# Altium schematic sheet H3_Power.SchDoc
size A3
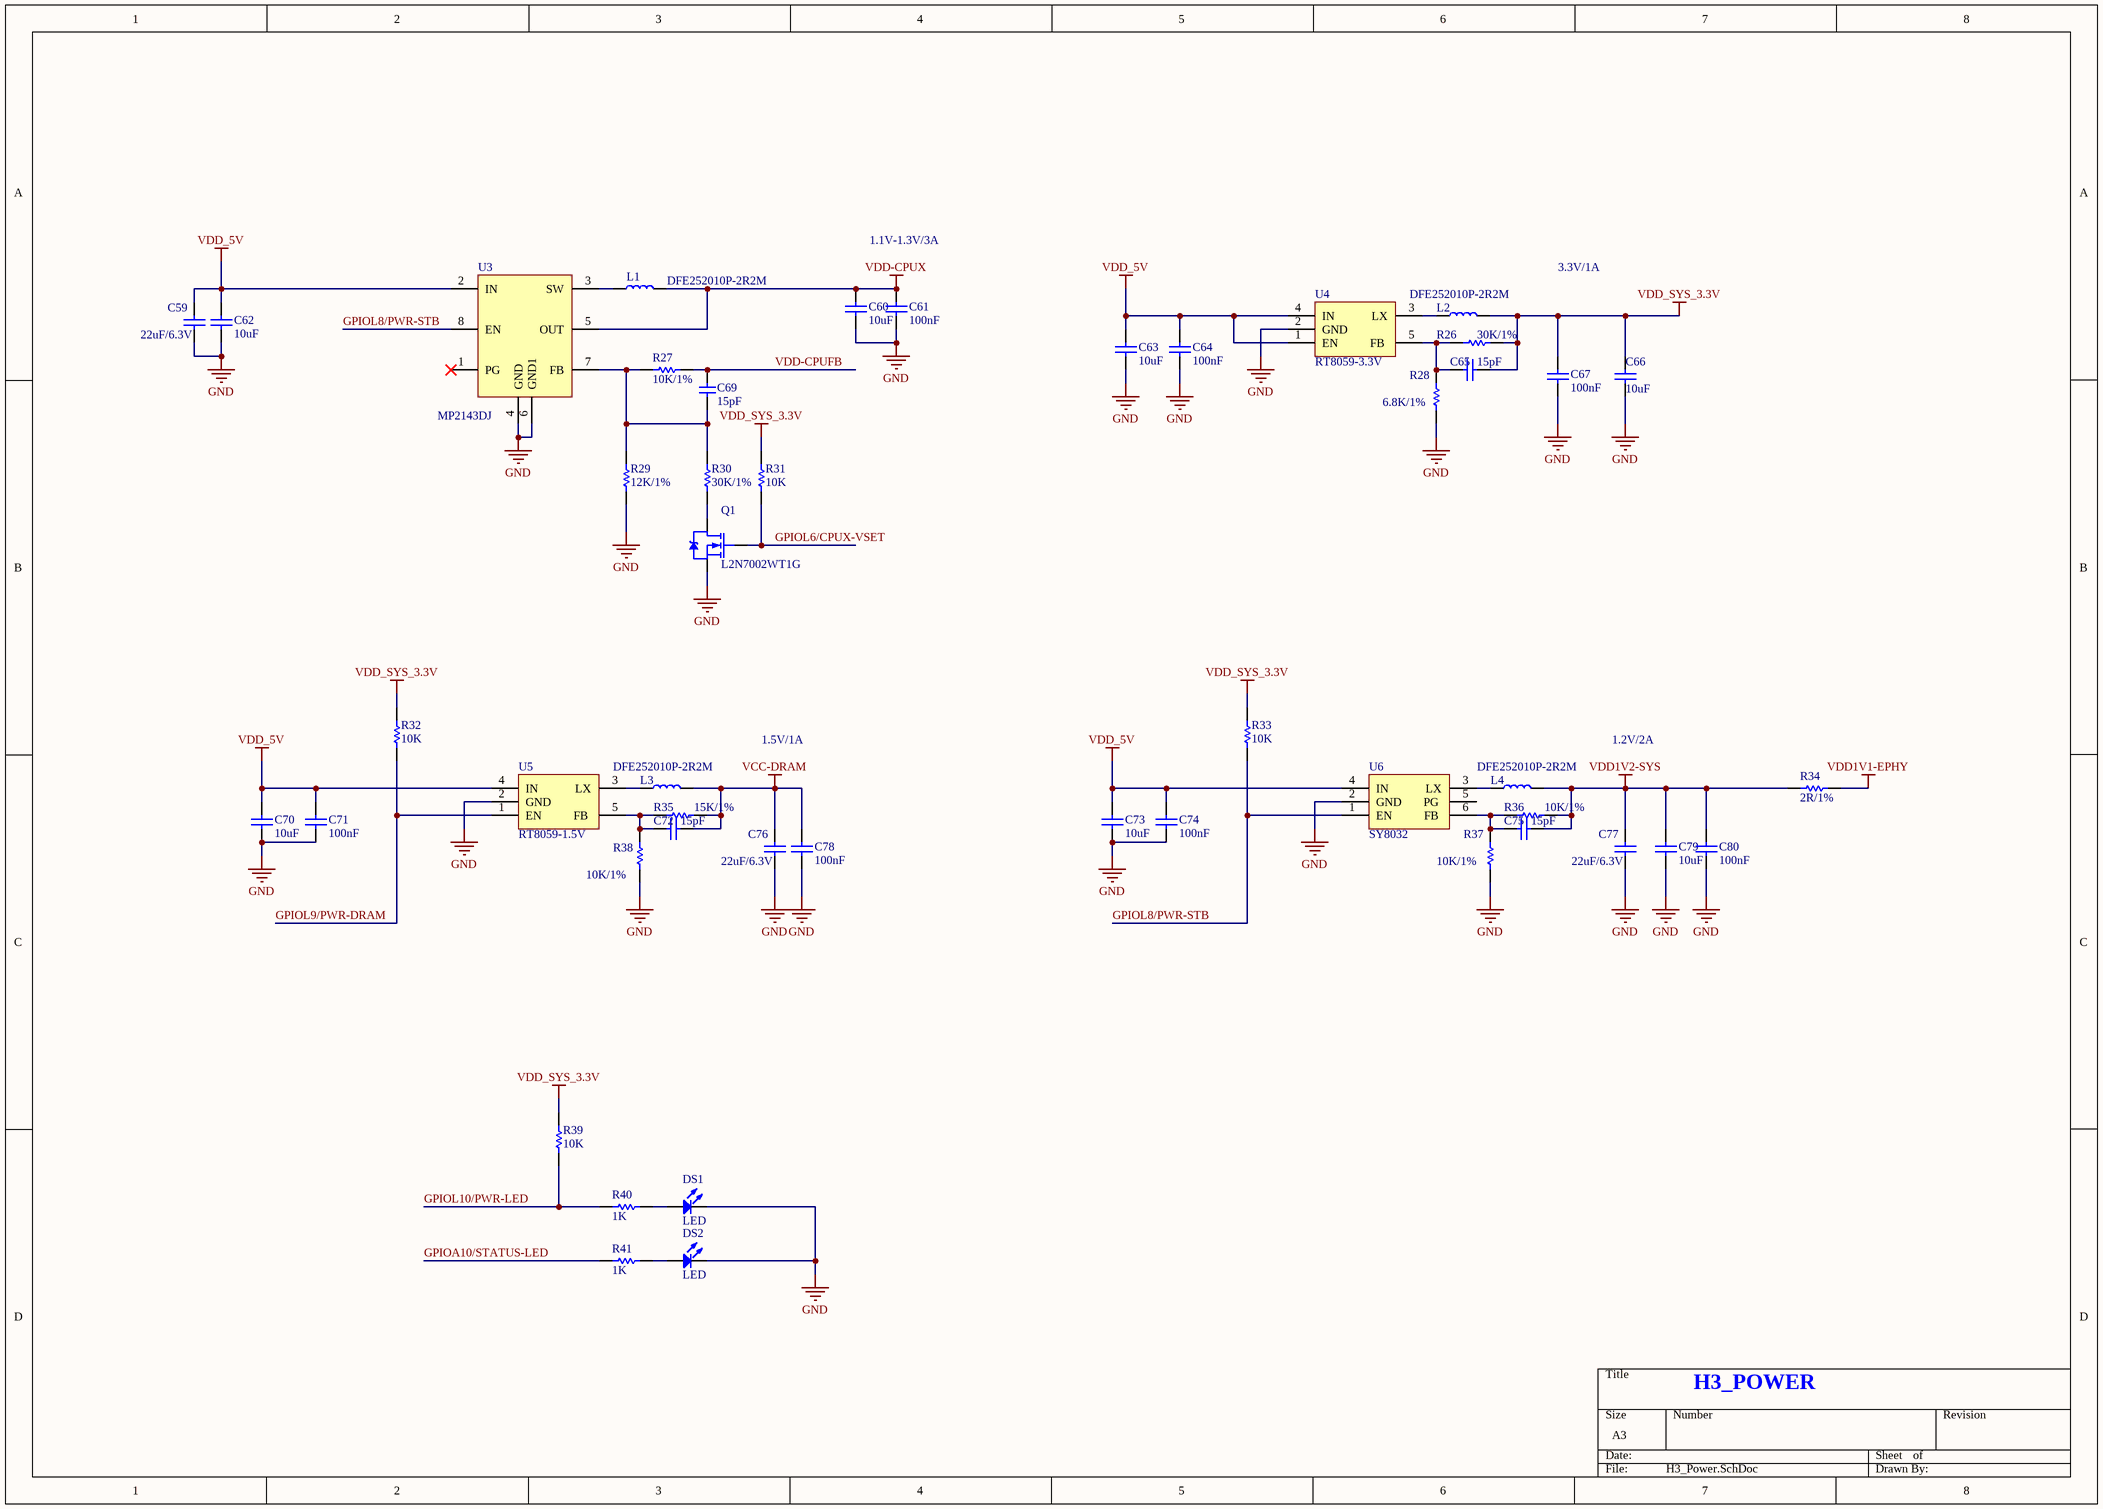
[diagram p0: H3_Power.SchDoc]

## Parts
C59  22uF/6.3V  [C0603]
C60  10uF  [C0603]
C61  100nF  [C0402]
C62  10uF  [C0603]
C63  10uF  [C0603]
C64  100nF  [C0402]
C65  15pF  [C0402]
C66  10uF  [C0603]
C67  100nF  [C0402]
C69  15pF  [C0402]
C70  10uF  [C0603]
C71  100nF  [C0402]
C72  15pF  [C0402]
C73  10uF  [C0603]
C74  100nF  [C0402]
C75  15pF  [C0402]
C76  22uF/6.3V  [C0603]
C77  22uF/6.3V  [C0603]
C78  100nF  [C0402]
C79  10uF  [C0603]
C80  100nF  [C0402]
DS1  LED  [LED0603]
DS2  LED  [LED0603]
L1  DFE252010P-2R2M  [L2520]
L2  DFE252010P-2R2M  [L2520]
L3  DFE252010P-2R2M  [L2520]
L4  DFE252010P-2R2M  [L2520]
Q1  L2N7002WT1G  [SOT-23-3L]
R26  30K/1%  [R0402]
R27  10K/1%  [R0402]
R28  6.8K/1%  [R0402]
R29  12K/1%  [R0402]
R30  30K/1%  [R0402]
R31  10K  [R0402]
R32  10K  [R0402]
R33  10K  [R0402]
R34  2R/1%  [R0402]
R35  15K/1%  [R0402]
R36  10K/1%  [R0402]
R37  10K/1%  [R0402]
R38  10K/1%  [R0402]
R39  10K  [R0402]
R40  1K  [R0402]
R41  1K  [R0402]
U3  MP2143DJ  [TSOT23-8]
U4  RT8059-3.3V  [SOT-23-5]
U5  RT8059-1.5V  [SOT-23-5]
U6  SY8032  [SOT23-6]

## Nets
GND: C59.1 C60.1 C61.2 C62.1 C63.1 C64.1 C66.1 C67.2 C70.1 C71.2 C73.1 C74.2 C76.1 C77.1 C78.2 C79.1 C80.2 DS1.2(K) DS2.2(K) Q1.3(S) R28.1 R29.1 R37.1 R38.1 U3.4(GND) U3.6(GND1) U4.2(GND) U5.2(GND) U6.2(GND)
VCC-DRAM: C72.2 C76.2 C78.1 L3.1 R35.1
VDD1V1-EPHY: R34.1
VDD1V2-SYS: C75.2 C77.2 C79.2 C80.1 L4.1 R34.2 R36.1
VDD-CPUX: C60.2 C61.1 L1.1 U3.5(OUT)
VDD_5V: C59.2 C62.2 C63.2 C64.2 C70.2 C71.1 C73.2 C74.1 U3.2(IN) U4.1(EN) U4.4(IN) U5.4(IN) U6.4(IN)
VDD_SYS_3.3V: C65.1 C66.2 C67.1 L2.1 R26.1 R31.2 R32.2 R33.2 R39.2
GPIOA10/STATUS-LED: R41.2
GPIOL6/CPUX-VSET: Q1.1(G) R31.1
GPIOL8/PWR-STB: R33.1 U3.8(EN) U6.1(EN)
GPIOL9/PWR-DRAM: R32.1 U5.1(EN)
GPIOL10/PWR-LED: R39.1 R40.2
VDD-CPUFB: C69.2 R27.1
NetC65_2: C65.2 R26.2 R28.2 U4.5(FB)
NetC69_1: C69.1 R27.2 R29.2 R30.2 U3.7(FB)
NetC72_1: C72.1 R35.2 R38.2 U5.5(FB)
NetC75_1: C75.1 R36.2 R37.2 U6.6(FB)
NetDS1_1: DS1.1(A) R40.1
NetDS2_1: DS2.1(A) R41.1
NetL1_2: L1.2 U3.3(SW)
NetL2_2: L2.2 U4.3(LX)
NetL3_2: L3.2 U5.3(LX)
NetL4_2: L4.2 U6.3(LX)
NetQ1_2: Q1.2(D) R30.1

Not connected (* = marked no-connect by the designer): U3 1(PG)*; U6 5(PG)

## Notes on the sheet
- 1.1V-1.3V/3A
- 3.3V/1A
- 1.5V/1A
- 1.2V/2A
- H3_POWER

## Library data of the parts
C59 C60 C62 C63 C66 C70 C73 C76 C77 C79 = C0603: 电容; Published: 8-Jun-2000; LatestRevisionDate: 17-Jul-2002; LatestRevisionNote: Re-released for DXP Platform.; PackageReference: RAD-0.3; Publisher: Altium Limited; PackageDescription: Radial Cap, Thru-Hole; 2 Leads; 0.3 in Pin Spacing; UnitPrice: 0.02
C61 C64 C65 C67 C71 C72 C74 C75 C78 C80 = C0402: 电容; Published: 8-Jun-2000; LatestRevisionDate: 17-Jul-2002; LatestRevisionNote: Re-released for DXP Platform.; PackageReference: RAD-0.3; Publisher: Altium Limited; PackageDescription: Radial Cap, Thru-Hole; 2 Leads; 0.3 in Pin Spacing; UnitPrice: 0.02
C69 = C: 电容; Published: 8-Jun-2000; LatestRevisionDate: 17-Jul-2002; LatestRevisionNote: Re-released for DXP Platform.; PackageReference: RAD-0.3; Publisher: Altium Limited; PackageDescription: Radial Cap, Thru-Hole; 2 Leads; 0.3 in Pin Spacing; UnitPrice: 0.02
DS1 DS2 = LED: Typical RED, GREEN, YELLOW, AMBER GaAs LED; Published: 8-Jun-2000; LatestRevisionDate: 17-Jul-2002; LatestRevisionNote: Re-released for DXP Platform.; PackageDocument: Feb-2002; PackageReference: 3.2X1.6X1.1; Publisher: Altium Limited; UnitPrice: 0.05
L1-L4 = L: 电感
Q1 = NMOS-2: N-Channel Power MOSFET; Note: Pin 2 is electrically connected to pin 4.; Published: 8-Jun-2000; LatestRevisionDate: 17-Jul-2002; LatestRevisionNote: Re-released for DXP Platform.; DatasheetVersion: PD-9.814; PackageVersion: Feb-1997; PackageReference: TO-220AB; Publisher: Altium Limited; PackageDescription: TO, Thru-Hole, Vertical, Heatsink Mounted; 3 In-Line Leads; Pitch 2.54 mm; ComponentLink1Description: Manufacturer Link; ComponentLink1URL: http://www.irf.com/
R26-R41 = RES0402: 电阻; Published: 8-Jun-2000; LatestRevisionDate: 17-Jul-2002; LatestRevisionNote: Re-released for DXP Platform.; PackageReference: AXIAL-0.3; Publisher: Altium Limited; PackageDescription: Axial Device, Thru-Hole; 2 Leads; 0.3 in Pin Spacing
U4 U5 = RT8059